# Altium project 002.botom.PrjPcb
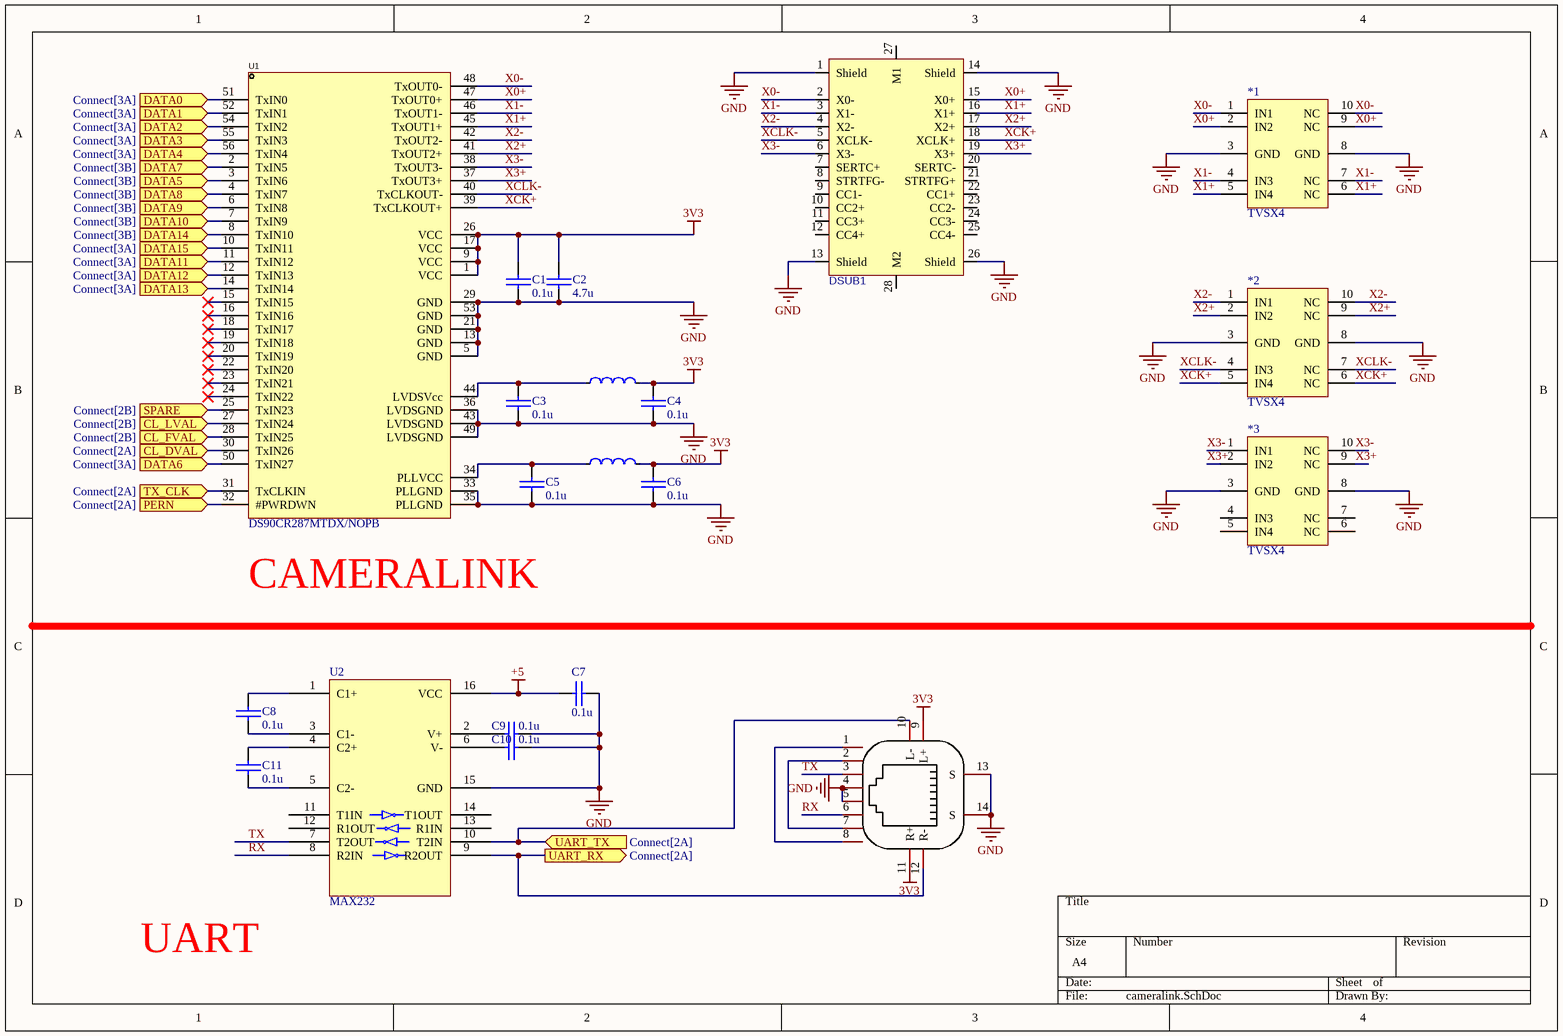
[diagram p0: cameralink.SchDoc]
3 sheets, 89 parts. Net scope: flat (ports and power ports of the same name join across sheets).
Board file: ccd_bottom.PcbDoc
Sheets:
  cameralink.SchDoc
  Connect.SchDoc
  power.SchDoc

## Sheet cameralink.SchDoc
size A4; SheetNumber: 2; SheetTotal: 4

### Parts
*1  TVSX4  [DFN-10]
*2  TVSX4  [DFN-10]
*3  TVSX4  [DFN-10]
C1  0.1u  [0603C]
C2  4.7u  [0603C]
C3  0.1u  [0603C]
C4  0.1u  [0603C]
C5  0.1u  [0603C]
C6  0.1u  [0603C]
C7  0.1u  [0603C]
C8  0.1u  [0603C]
C9  0.1u  [0603C]
C10  0.1u  [0603C]
C11  0.1u  [0603C]
DSUB1  6321-026RDS1MWA02  [MDR-26-horizontal]  (value not drawn)
L1  GZ1608D601TF  [0603L]  (value not drawn)
L2  GZ1608D601TF  [0603L]  (value not drawn)
RJ1  R-RJ45R08P-C000  [RJ45-TH_R-RJ45R08P-C000]  (value not drawn)
U1  DS90CR287MTDX/NOPB  [TSSOP-56_L14.0-W6.1-P0.50-LS8.1-BL]
U2  MAX232  [SOP16]

### Ports
CL_DVAL (in, see Connect[2A]), CL_FVAL (in, see Connect[2B]), CL_LVAL (in, see Connect[2B]), DATA0 (in, see Connect[3A]), DATA1 (in, see Connect[3A]), DATA2 (in, see Connect[3A]), DATA3 (in, see Connect[3A]), DATA4 (in, see Connect[3A]), DATA5 (in, see Connect[3B]), DATA6 (in, see Connect[3A]), DATA7 (in, see Connect[3B]), DATA8 (in, see Connect[3B]), DATA9 (in, see Connect[3B]), DATA10 (in, see Connect[3B]), DATA11 (in, see Connect[3A]), DATA12 (in, see Connect[3A]), DATA13 (in, see Connect[3A]), DATA14 (in, see Connect[3B]), DATA15 (in, see Connect[3A]), PERN (in, see Connect[2A]), SPARE (in, see Connect[2B]), TX_CLK (in, see Connect[2A]), UART_RX (out, see Connect[2A]), UART_TX (in, see Connect[2A])

### Nets
3V3: C1.2 C2.2 C4.2 C6.2 L1.2 L2.2 RJ1.9(L+) RJ1.11(R+) U1.1(VCC) U1.9(VCC) U1.17(VCC) U1.26(VCC)
+5: C7.2 U2.16(VCC)
GND: *1.3(GND) *1.8(GND) *2.3(GND) *2.8(GND) *3.3(GND) *3.8(GND) C1.1 C2.1 C3.1 C4.1 C5.1 C6.1 C7.1 C9.1 C10.1 DSUB1.1(Shield) DSUB1.13(Shield) DSUB1.14(Shield) DSUB1.26(Shield) RJ1.4 RJ1.5 RJ1.13(S) RJ1.14(S) U1.5(GND) U1.13(GND) U1.21(GND) U1.29(GND) U1.33(PLLGND) U1.35(PLLGND) U1.36(LVDSGND) U1.43(LVDSGND) U1.49(LVDSGND) U1.53(GND) U2.15(GND)
B15_IO0: RJ1.12(R-) U2.9(R2OUT) ; port UART_RX
B15_IO25: U1.50(TxIN27) ; port DATA6
B15_L1_N: U1.8(TxIN10) ; port DATA14
B15_L1_P: U1.7(TxIN9) ; port DATA10
B15_L2_N: U1.56(TxIN4) ; port DATA4
B15_L2_P: U1.55(TxIN3) ; port DATA3
B15_L3_N: U1.3(TxIN6) ; port DATA5
B15_L3_P: U1.2(TxIN5) ; port DATA7
B15_L4_N: U1.54(TxIN2) ; port DATA2
B15_L4_P: U1.52(TxIN1) ; port DATA1
B15_L5_N: U1.4(TxIN7) ; port DATA8
B15_L5_P: U1.6(TxIN8) ; port DATA9
B15_L7_P: U1.28(TxIN25) ; port CL_FVAL
B15_L9_N: U1.25(TxIN23) ; port SPARE
B15_L9_P: U1.27(TxIN24) ; port CL_LVAL
B15_L11_N: U1.10(TxIN11) ; port DATA15
B15_L11_P: U1.11(TxIN12) ; port DATA11
B15_L12_N: U1.12(TxIN13) ; port DATA12
B15_L12_P: U1.14(TxIN14) ; port DATA13
B16_IO0: RJ1.10(L-) U2.10(T2IN) ; port UART_TX
B16_IO25: U1.51(TxIN0) ; port DATA0
B16_L22_N: U1.30(TxIN26) ; port CL_DVAL
B16_L22_P: U1.31(TxCLKIN) ; port TX_CLK
B16_L23_N: U1.32(#PWRDWN) ; port PERN
RX: RJ1.6 U2.8(R2IN)
TX: RJ1.3 U2.7(T2OUT)
X0+: *1.2(IN2) *1.9(NC) DSUB1.15(X0+) U1.47(TxOUT0+)
X0-: *1.1(IN1) *1.10(NC) DSUB1.2(X0-) U1.48(TxOUT0-)
X1+: *1.5(IN4) *1.6(NC) DSUB1.16(X1+) U1.45(TxOUT1+)
X1-: *1.4(IN3) *1.7(NC) DSUB1.3(X1-) U1.46(TxOUT1-)
X2+: *2.2(IN2) *2.9(NC) DSUB1.17(X2+) U1.41(TxOUT2+)
X2-: *2.1(IN1) *2.10(NC) DSUB1.4(X2-) U1.42(TxOUT2-)
X3+: *3.2(IN2) *3.9(NC) DSUB1.19(X3+) U1.37(TxOUT3+)
X3-: *3.1(IN1) *3.10(NC) DSUB1.6(X3-) U1.38(TxOUT3-)
XCK+: *2.5(IN4) *2.6(NC) DSUB1.18(XCLK+) U1.39(TxCLKOUT+)
XCLK-: *2.4(IN3) *2.7(NC) DSUB1.5(XCLK-) U1.40(TxCLKOUT-)
NetC3_2: C3.2 L1.1 U1.44(LVDSVcc)
NetC5_2: C5.2 L2.1 U1.34(PLLVCC)
NetC8_1: C8.1 U2.3(C1-)
NetC8_2: C8.2 U2.1(C1+)
NetC9_2: C9.2 U2.2(V+)
NetC10_2: C10.2 U2.6(V-)
NetC11_1: C11.1 U2.5(C2-)
NetC11_2: C11.2 U2.4(C2+)
NetRJ1_1: RJ1.1 RJ1.8
NetRJ1_2: RJ1.2 RJ1.7

Not connected (* = marked no-connect by the designer): *3 4(IN3) 5(IN4) 6(NC) 7(NC); DSUB1 7(SERTC+) 8(STRTFG-) 9(CC1-) 10(CC2+) 11(CC3+) 12(CC4+) 20(SERTC-) 21(STRTFG+) 22(CC1+) 23(CC2-) 24(CC3-) 25(CC4-) 27(M1) 28(M2); U1 15(TxIN15)* 16(TxIN16)* 18(TxIN17)* 19(TxIN18)* 20(TxIN19)* 22(TxIN20)* 23(TxIN21)* 24(TxIN22)*; U2 11(T1IN) 12(R1OUT) 13(R1IN) 14(T1OUT)

### Notes on the sheet
- (near U1) CAMERALINK
- UART

### Library data of the parts
*1-*3 = TVSX4: 瞬态抑制二极管
C1-C11 = CAP: 无极性电容
DSUB1 = MDR-26: BOM_Manufacturer: Wcon; Contributor: LCSC; BOM_Supplier: LCSC; BOM_Supplier Part: C843200; BOM_Manufacturer Part: 6321-026RDS1MWA02; BOM_JLCPCB Part Class: Extended Part; spicePre: D; spiceSymbolName: 6321-026RDS1MWA02
L1 L2 = FB: 铁氧体磁珠; Manufacturer: Sunlord(顺络); Add into BOM: yes; Impedance @ Frequency: 600Ω@100MHz; Tolerance: ±25%; DC Resistance: 450mΩ; Current Rating: 200mA; Circuits: 1; Name: GZ1608D601TF; Symbol: GZ1608D601TF; Device: GZ1608D601TF; LCSC Part Name: 600Ω@100MHz ±25%; Supplier Part: C1002; Manufacturer Part: GZ1608D601TF; Supplier Footprint: 0603; JLCPCB Part Class: Basic Part; Datasheet: https://atta.szlcsc.com/upload/public/pdf/source/20210830/355EA7C0FAC5394FC0FE3F17C770C20A.pdf; Supplier: LCSC; Convert to PCB: yes
RJ1 = RJ45R08P: RJ45; Manufacturer: Ckmtw(灿科盟); Add into BOM: yes; Connector Type: RJ插座; Number of Ports: 1; Shielding: 有; LED: 带LED; Name: R-RJ45R08P-C000; Symbol: R-RJ45R08P-C000; Device: R-RJ45R08P-C000; LCSC Part Name: RJ45 弯插 带LED 8P/8C 铜壳带屏蔽 短体  无弹片; Supplier Part: C386757; Manufacturer Part: R-RJ45R08P-C000; Supplier Footprint: 插件; JLCPCB Part Class: Extended Part; Datasheet: https://atta.szlcsc.com/upload/public/pdf/source/20190508/C386757_590BCC8A33AAEEF7838490D656B2E4CF.pdf; Supplier: LCSC; Convert to PCB: yes; USOC Codes: RJ45; Ratings: -; Mounting Style: 弯插; Operating Temperature Range: 0℃~+70℃
U1 = DS90CR287MTDX/NOPB: cameralink编码; Manufacturer: TI(德州仪器); Add into BOM: yes; Name: DS90CR287MTDX/NOPB; Symbol: DS90CR287MTDX/NOPB; Device: DS90CR287MTDX/NOPB; LCSC Part Name: DS90CR287MTDX/NOPB; Supplier Part: C87059; Manufacturer Part: DS90CR287MTDX/NOPB; Supplier Footprint: TSSOP-56; JLCPCB Part Class: Extended Part; Datasheet: https://atta.szlcsc.com/upload/public/pdf/source/20181012/C87059_649258B21BE4DAB0D862C5E1E6C719D7.pdf; Supplier: LCSC; Convert to PCB: yes

## Sheet Connect.SchDoc
size A4; SheetNumber: 4; SheetTotal: 4
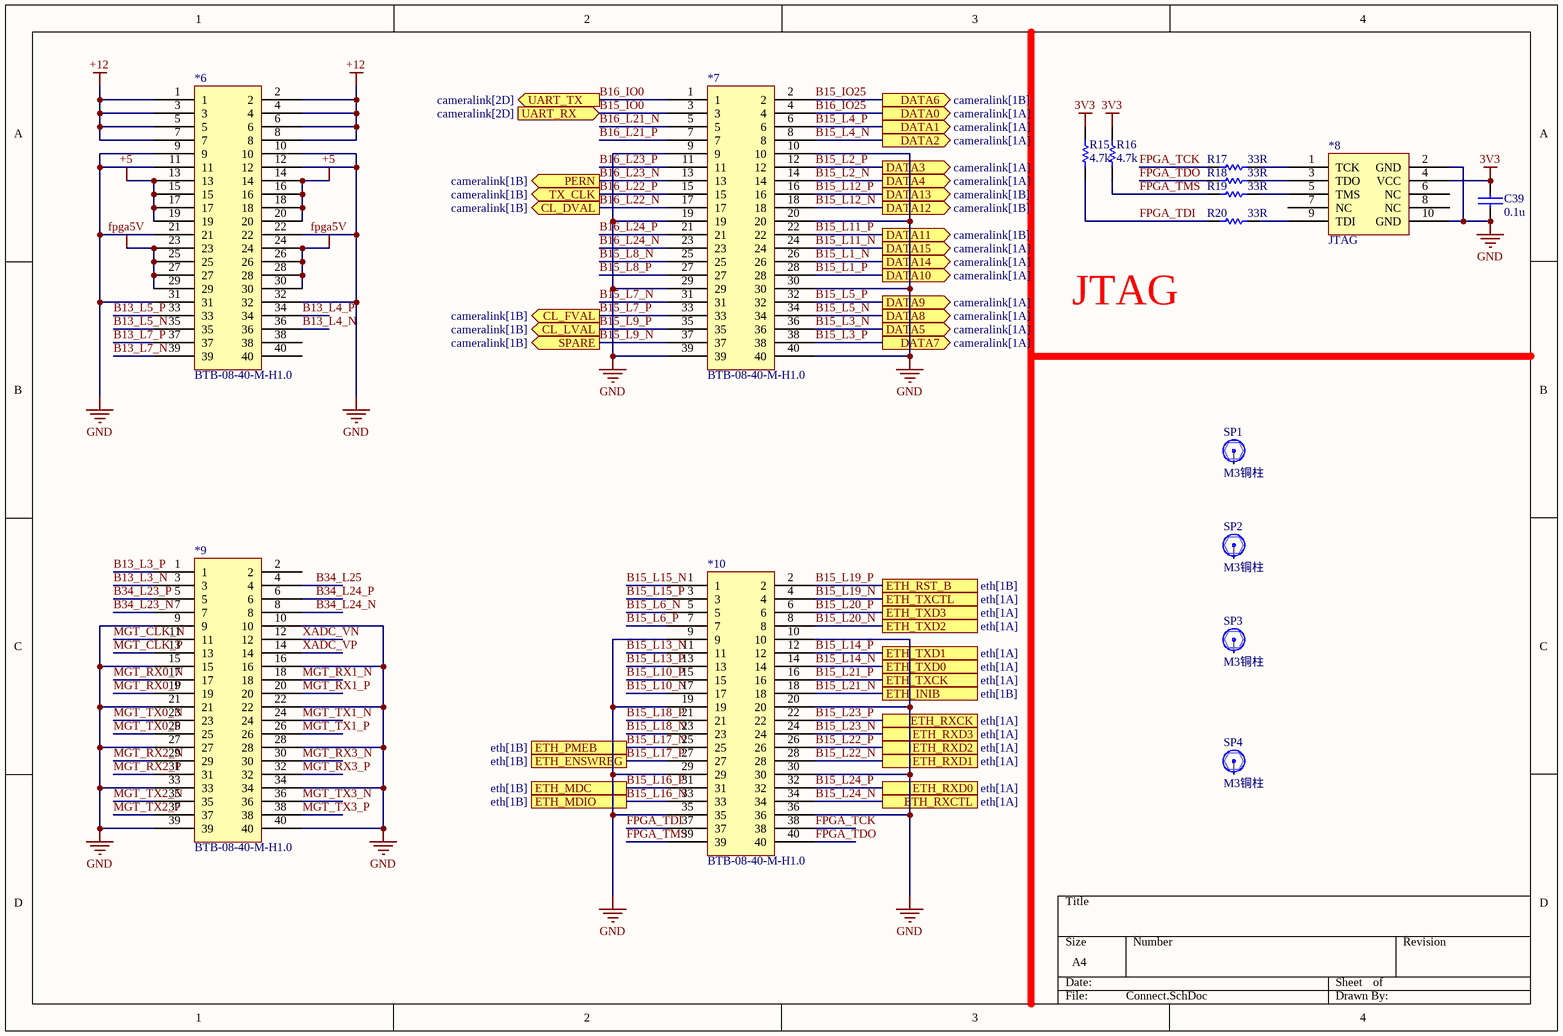
[diagram p1: Connect.SchDoc]

### Parts
*6  BTB-08-40-M-H1.0  [BTB-08-40-M-H1.0]
*7  BTB-08-40-M-H1.0  [BTB-08-40-M-H1.0]
*8  JTAG  [IDC-TH_10P-P2.54-H-R2-C5-S2.54]
*9  BTB-08-40-M-H1.0  [BTB-08-40-M-H1.0]
*10  BTB-08-40-M-H1.0  [BTB-08-40-M-H1.0]
C39  0.1u  [0603C]
R15  4.7k  [0603R]
R16  4.7k  [0603R]
R17  33R  [0603R]
R18  33R  [0603R]
R19  33R  [0603R]
R20  33R  [0603R]
SP1  M3铜柱  [M3x4_N]
SP2  M3铜柱  [M3x4_N]
SP3  M3铜柱  [M3x4_N]
SP4  M3铜柱  [M3x4_N]

### Ports
CL_DVAL (out, see cameralink[1B]), CL_FVAL (out, see cameralink[1B]), CL_LVAL (out, see cameralink[1B]), DATA0 (out, see cameralink[1A]), DATA1 (out, see cameralink[1A]), DATA2 (out, see cameralink[1A]), DATA3 (out, see cameralink[1A]), DATA4 (out, see cameralink[1A]), DATA5 (out, see cameralink[1A]), DATA6 (out, see cameralink[1B]), DATA7 (out, see cameralink[1A]), DATA8 (out, see cameralink[1A]), DATA9 (out, see cameralink[1A]), DATA10 (out, see cameralink[1A]), DATA11 (out, see cameralink[1B]), DATA12 (out, see cameralink[1B]), DATA13 (out, see cameralink[1B]), DATA14 (out, see cameralink[1A]), DATA15 (out, see cameralink[1A]), ETH_ENSWREG (see eth[1B]), ETH_INIB (see eth[1B]), ETH_MDC (see eth[1B]), ETH_MDIO (see eth[1B]), ETH_PMEB (see eth[1B]), ETH_RST_B (see eth[1B]), ETH_RXCK (see eth[1A]), ETH_RXCTL (see eth[1A]), ETH_RXD0 (see eth[1A]), ETH_RXD1 (see eth[1A]), ETH_RXD2 (see eth[1A]), ETH_RXD3 (see eth[1A]), ETH_TXCK (see eth[1A]), ETH_TXCTL (see eth[1A]), ETH_TXD0 (see eth[1A]), ETH_TXD1 (see eth[1A]), ETH_TXD2 (see eth[1A]), ETH_TXD3 (see eth[1A]), PERN (out, see cameralink[1B]), SPARE (out, see cameralink[1B]), TX_CLK (out, see cameralink[1B]), UART_RX (in, see cameralink[2D]), UART_TX (out, see cameralink[2D])

### Nets
3V3: *8.4(VCC) C39.2 R15.2 R16.2
+5: *6.13 *6.14 *6.15 *6.16 *6.17 *6.18 *6.19 *6.20
+12: *6.1 *6.2 *6.3 *6.4 *6.5 *6.6 *6.7 *6.8
fpga5V: *6.23 *6.24 *6.25 *6.26 *6.27 *6.28 *6.29 *6.30
GND: *6.9 *6.10 *6.11 *6.12 *6.21 *6.22 *6.31 *6.32 *7.9 *7.10 *7.19 *7.20 *7.29 *7.30 *7.39 *7.40 *8.2(GND) *8.10(GND) *9.9 *9.10 *9.15 *9.16 *9.21 *9.22 *9.27 *9.28 *9.33 *9.34 *9.39 *9.40 *10.9 *10.10 *10.19 *10.20 *10.29 *10.30 *10.35 *10.36 C39.1
B13_L3_N: *9.3
B13_L3_P: *9.1
B13_L4_N: *6.36
B13_L4_P: *6.34
B13_L5_N: *6.35
B13_L5_P: *6.33
B13_L7_N: *6.39
B13_L7_P: *6.37
B15_IO0: *7.3 ; port UART_RX
B15_IO25: *7.2 ; port DATA6
B15_L1_N: *7.26 ; port DATA14
B15_L1_P: *7.28 ; port DATA10
B15_L2_N: *7.14 ; port DATA4
B15_L2_P: *7.12 ; port DATA3
B15_L3_N: *7.36 ; port DATA5
B15_L3_P: *7.38 ; port DATA7
B15_L4_N: *7.8 ; port DATA2
B15_L4_P: *7.6 ; port DATA1
B15_L5_N: *7.34 ; port DATA8
B15_L5_P: *7.32 ; port DATA9
B15_L6_N: *10.5
B15_L6_P: *10.7
B15_L7_N: *7.31
B15_L7_P: *7.33 ; port CL_FVAL
B15_L8_N: *7.25
B15_L8_P: *7.27
B15_L9_N: *7.37 ; port SPARE
B15_L9_P: *7.35 ; port CL_LVAL
B15_L10_N: *10.17
B15_L10_P: *10.15
B15_L11_N: *7.24 ; port DATA15
B15_L11_P: *7.22 ; port DATA11
B15_L12_N: *7.18 ; port DATA12
B15_L12_P: *7.16 ; port DATA13
B15_L13_N: *10.11
B15_L13_P: *10.13
B15_L14_N: *10.14 ; port ETH_TXD0
B15_L14_P: *10.12 ; port ETH_TXD1
B15_L15_N: *10.1
B15_L15_P: *10.3
B15_L16_N: *10.33 ; port ETH_MDIO
B15_L16_P: *10.31 ; port ETH_MDC
B15_L17_N: *10.25 ; port ETH_PMEB
B15_L17_P: *10.27 ; port ETH_ENSWREG
B15_L18_N: *10.23
B15_L18_P: *10.21
B15_L19_N: *10.4 ; port ETH_TXCTL
B15_L19_P: *10.2 ; port ETH_RST_B
B15_L20_N: *10.8 ; port ETH_TXD2
B15_L20_P: *10.6 ; port ETH_TXD3
B15_L21_N: *10.18 ; port ETH_INIB
B15_L21_P: *10.16 ; port ETH_TXCK
B15_L22_N: *10.28 ; port ETH_RXD1
B15_L22_P: *10.26 ; port ETH_RXD2
B15_L23_N: *10.24 ; port ETH_RXD3
B15_L23_P: *10.22 ; port ETH_RXCK
B15_L24_N: *10.34 ; port ETH_RXCTL
B15_L24_P: *10.32 ; port ETH_RXD0
B16_IO0: *7.1 ; port UART_TX
B16_IO25: *7.4 ; port DATA0
B16_L21_N: *7.5
B16_L21_P: *7.7
B16_L22_N: *7.17 ; port CL_DVAL
B16_L22_P: *7.15 ; port TX_CLK
B16_L23_N: *7.13 ; port PERN
B16_L23_P: *7.11
B16_L24_N: *7.23
B16_L24_P: *7.21
B34_L23_N: *9.7
B34_L23_P: *9.5
B34_L24_N: *9.8
B34_L24_P: *9.6
B34_L25: *9.4
FPGA_TCK: *10.38 R17.1
FPGA_TDI: *10.37 R15.1 R20.1
FPGA_TDO: *10.40 R18.1
FPGA_TMS: *10.39 R16.1 R19.1
MGT_CLK_N: *9.11
MGT_CLK_P: *9.13
MGT_RX0_N: *9.17
MGT_RX0_P: *9.19
MGT_RX1_N: *9.18
MGT_RX1_P: *9.20
MGT_RX2_N: *9.29
MGT_RX2_P: *9.31
MGT_RX3_N: *9.30
MGT_RX3_P: *9.32
MGT_TX0_N: *9.23
MGT_TX0_P: *9.25
MGT_TX1_N: *9.24
MGT_TX1_P: *9.26
MGT_TX2_N: *9.35
MGT_TX2_P: *9.37
MGT_TX3_N: *9.36
MGT_TX3_P: *9.38
XADC_VN: *9.12
XADC_VP: *9.14
Net*8_1: *8.1(TCK) R17.2
Net*8_3: *8.3(TDO) R18.2
Net*8_5: *8.5(TMS) R19.2
Net*8_9: *8.9(TDI) R20.2

Not connected (* = marked no-connect by the designer): *6 38 40; *8 6(NC) 7(NC) 8(NC); *9 2; SP1 1; SP2 1; SP3 1; SP4 1

### Notes on the sheet
- JTAG

### Library data of the parts
C39 = CAP: 无极性电容
R15-R20 = RES: 电阻
SP1-SP4 = 铜柱大焊盘: 铜柱; 版权归属: 封装库来自淘宝 ID：黄晶宝石; BOM名称: 铜柱; 学习资源: https://shop463601444.taobao.com

## Sheet power.SchDoc
size A4; SheetNumber: 1; SheetTotal: 4
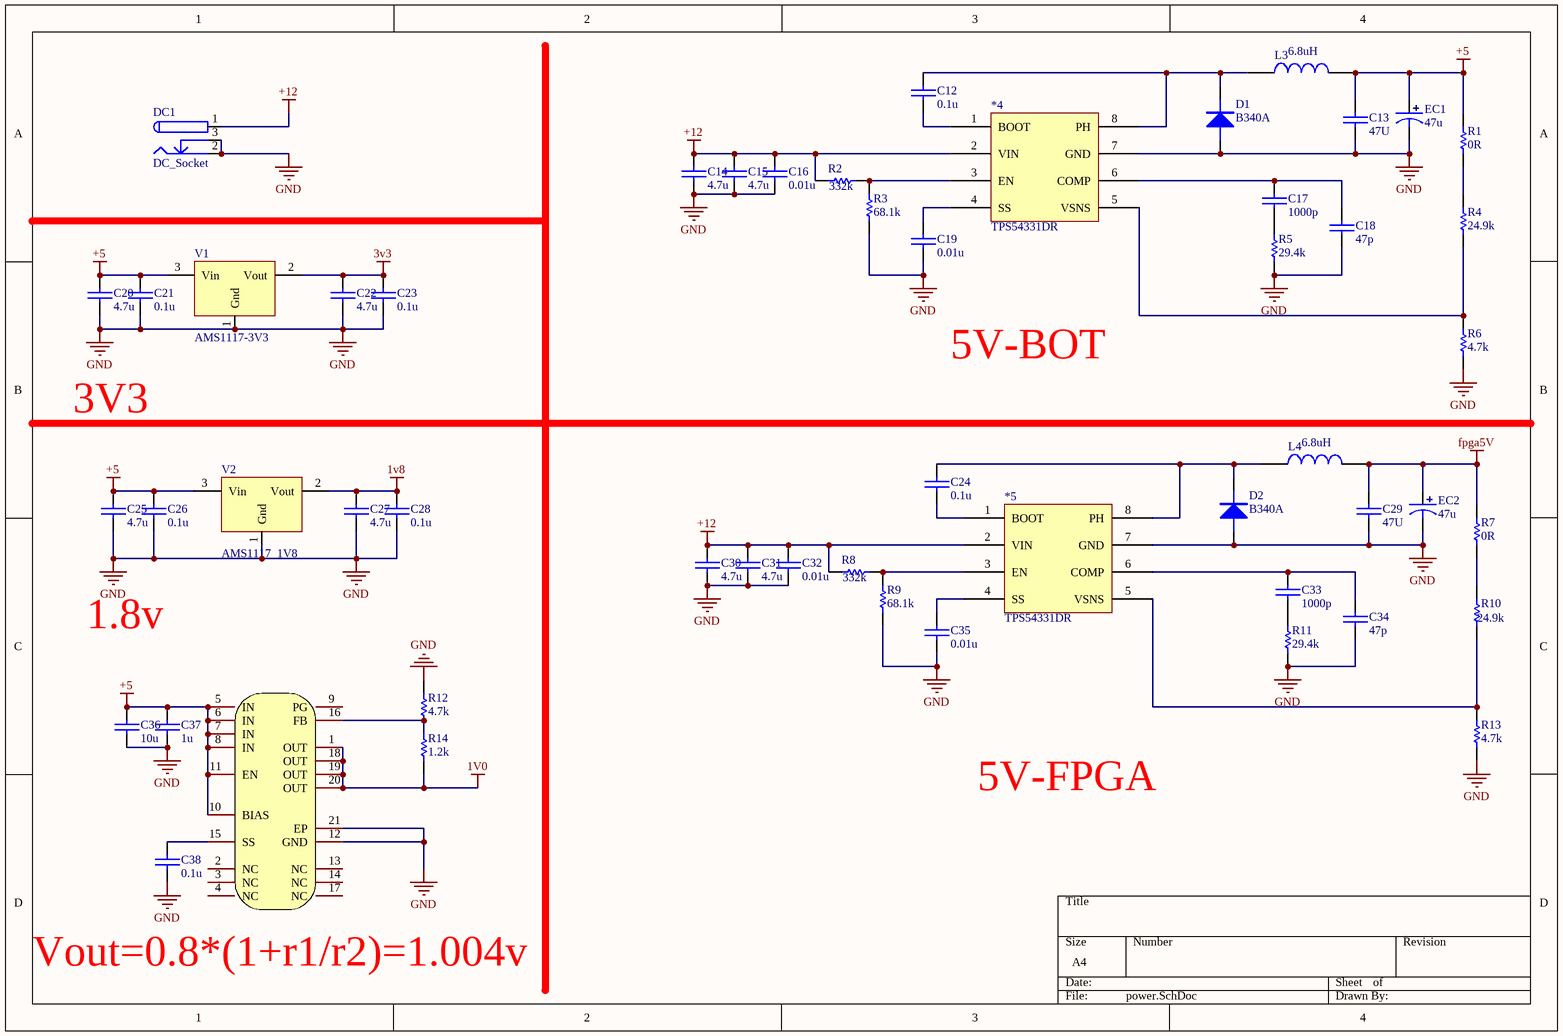
[diagram p2: power.SchDoc]

### Parts
*4  TPS54331DR  [SOIC-8]
*5  TPS54331DR  [SOIC-8]
C12  0.1u  [0603C]
C13  47U  [0603C]
C14  4.7u  [0603C]
C15  4.7u  [0603C]
C16  0.01u  [0603C]
C17  1000p  [0603C]
C18  47p  [0603C]
C19  0.01u  [0603C]
C20  4.7u  [0603C]
C21  0.1u  [0603C]
C22  4.7u  [0603C]
C23  0.1u  [0603C]
C24  0.1u  [0603C]
C25  4.7u  [0603C]
C26  0.1u  [0603C]
C27  4.7u  [0603C]
C28  0.1u  [0603C]
C29  47U  [0603C]
C30  4.7u  [0603C]
C31  4.7u  [0603C]
C32  0.01u  [0603C]
C33  1000p  [0603C]
C34  47p  [0603C]
C35  0.01u  [0603C]
C36  10u  [0603C]
C37  1u  [0603C]
C38  0.1u  [0603C]
D1  B340A  [SMA/DO-214AC]
D2  B340A  [SMA/DO-214AC]
DC1  DC_Socket  [DC-005]
EC1  47u  [SMD-EC6.3X6.3X10]
EC2  47u  [SMD-EC6.3X6.3X10]
L3  6.8uH  [L-SMD-0630]
L4  6.8uH  [L-SMD-0630]
R1  0R  [0603R]
R2  332k  [0603R]
R3  68.1k  [0603R]
R4  24.9k  [0603R]
R5  29.4k  [0603R]
R6  4.7k  [0603R]
R7  0R  [0603R]
R8  332k  [0603R]
R9  68.1k  [0603R]
R10  24.9k  [0603R]
R11  29.4k  [0603R]
R12  4.7k  [0603R]
R13  4.7k  [0603R]
R14  1.2k  [0603R]
U3  TPS74401RGWR  [VQFN-20_L5.0-W5.0-P0.65-TL-EP]  (value not drawn)
V1  AMS1117-3V3  [SOT223_L]
V2  AMS1117_1V8  [SOT223_L]

### Nets
1V0: R14.1 U3.1(OUT) U3.18(OUT) U3.19(OUT) U3.20(OUT)
1v8: C27.2 C28.2 V2.2(Vout)
3V3: C22.2 C23.2 V1.2(Vout)
+5: C13.2 C20.2 C21.2 C25.2 C26.2 C36.2 C37.2 EC1.1 L3.2 R1.2 U3.5(IN) U3.6(IN) U3.7(IN) U3.8(IN) U3.10(BIAS) U3.11(EN) V1.3(Vin) V2.3(Vin)
+12: *4.2(VIN) *5.2(VIN) C14.2 C15.2 C16.2 C30.2 C31.2 C32.2 DC1.1 R2.2 R8.2
fpga5V: C29.2 EC2.1 L4.2 R7.2
GND: *4.7(GND) *5.7(GND) C13.1 C14.1 C15.1 C16.1 C18.1 C19.1 C20.1 C21.1 C22.1 C23.1 C25.1 C26.1 C27.1 C28.1 C29.1 C30.1 C31.1 C32.1 C34.1 C35.1 C36.1 C37.1 C38.1 D1.A D2.A DC1.2 DC1.3 EC1.2 EC2.2 R3.1 R5.1 R6.1 R9.1 R11.1 R12.2 R13.1 U3.12(GND) U3.21(EP) V1.1(Gnd) V2.1(Gnd)
Net*4_1: *4.1(BOOT) C12.1
Net*4_3: *4.3(EN) R2.1 R3.2
Net*4_4: *4.4(SS) C19.2
Net*4_5: *4.5(VSNS) R4.1 R6.2
Net*4_6: *4.6(COMP) C17.2 C18.2
Net*4_8: *4.8(PH) C12.2 D1.K L3.1
Net*5_1: *5.1(BOOT) C24.1
Net*5_3: *5.3(EN) R8.1 R9.2
Net*5_4: *5.4(SS) C35.2
Net*5_5: *5.5(VSNS) R10.1 R13.2
Net*5_6: *5.6(COMP) C33.2 C34.2
Net*5_8: *5.8(PH) C24.2 D2.K L4.1
NetC17_1: C17.1 R5.2
NetC33_1: C33.1 R11.2
NetC38_2: C38.2 U3.15(SS)
NetR1_1: R1.1 R4.2
NetR7_1: R7.1 R10.2
NetR12_1: R12.1 R14.2 U3.16(FB)

Not connected (* = marked no-connect by the designer): U3 2(NC) 3(NC) 4(NC) 9(PG) 13(NC) 14(NC) 17(NC)

### Notes on the sheet
- 5V-BOT
- 3V3
- 1.8v
- 5V-FPGA
- (near U3) Vout=0.8*(1+r1/r2)=1.004v

### Library data of the parts
*4 *5 = TPS54331DR: 降压型DC-DC
C12-C38 = CAP: 无极性电容
D1 D2 = DIODE: 普通二极管
EC1 EC2 = ECAP: 贴片电解电容
L3 L4 = L: INDUCTOR
R1-R14 = RES: 电阻
U3 = TPS74401RGWR: 单路输出 LDO、3.0A、可调节电压（0.8 至 3.3V）、快速瞬态响应、可编程软启动; Manufacturer: TI(德州仪器); Add into BOM: yes; Voltage - Input (Max): 5.5V; Voltage Dropout (Max): 240mV @ 3A; Voltage - Output (adj): 0.8V ~ 3.6V; Output Current (Max): 3A; Output Configuration: 正; Ripple Rejection (PSRR): 73dB ~ 50dB(1kHz ~ 800kHz); Output Type: 可调式; Number of Output Channels: 1; Name: TPS74401RGWR; Symbol: TPS74401RGWR; Device: TPS74401RGWR; LCSC Part Name: TPS74401RGWR; Supplier Part: C138728; Manufacturer Part: TPS74401RGWR; Supplier Footprint: VQFN-20_5x5x065P; JLCPCB Part Class: Extended Part; Datasheet: https://atta.szlcsc.com/upload/public/pdf/source/20171102/C138728_15096093098431078457.pdf; Supplier: LCSC; Convert to PCB: yes; Quiescent Current (Iq): -; Current - Supply (Max): -; Operating Temperature: -40℃~125℃(TJ); Enabling feet: -; Voltage - Output (Fixed): -
V1 = AMS1117-3V3: LDO; BOM名称: 稳压芯片; 封装库来自淘宝卖家：黄晶宝石: 其他店铺购入的买家，请立即申请退款，本店现金奖励200~1000元
V2 = AMS1117_1V8: LDO; BOM名称: 稳压芯片; 封装库来自淘宝卖家：黄晶宝石: 其他店铺购入的买家，请立即申请退款，本店现金奖励200~1000元

## Nets that join several sheets
3V3: cameralink (12 pins), Connect (*8.4 C39.2 R15.2 R16.2), power (C22.2 C23.2 V1.2)
+5: cameralink (C7.2 U2.16), Connect (8 pins), power (18 pins)
+12: Connect (8 pins), power (11 pins)
fpga5V: Connect (8 pins), power (C29.2 EC2.1 L4.2 R7.2)
GND: cameralink (34 pins), Connect (39 pins), power (42 pins)
B15_IO0: cameralink (RJ1.12 U2.9), Connect (*7.3)
B15_IO25: cameralink (U1.50), Connect (*7.2)
B15_L1_N: cameralink (U1.8), Connect (*7.26)
B15_L1_P: cameralink (U1.7), Connect (*7.28)
B15_L2_N: cameralink (U1.56), Connect (*7.14)
B15_L2_P: cameralink (U1.55), Connect (*7.12)
B15_L3_N: cameralink (U1.3), Connect (*7.36)
B15_L3_P: cameralink (U1.2), Connect (*7.38)
B15_L4_N: cameralink (U1.54), Connect (*7.8)
B15_L4_P: cameralink (U1.52), Connect (*7.6)
B15_L5_N: cameralink (U1.4), Connect (*7.34)
B15_L5_P: cameralink (U1.6), Connect (*7.32)
B15_L7_P: cameralink (U1.28), Connect (*7.33)
B15_L9_N: cameralink (U1.25), Connect (*7.37)
B15_L9_P: cameralink (U1.27), Connect (*7.35)
B15_L11_N: cameralink (U1.10), Connect (*7.24)
B15_L11_P: cameralink (U1.11), Connect (*7.22)
B15_L12_N: cameralink (U1.12), Connect (*7.18)
B15_L12_P: cameralink (U1.14), Connect (*7.16)
B16_IO0: cameralink (RJ1.10 U2.10), Connect (*7.1)
B16_IO25: cameralink (U1.51), Connect (*7.4)
B16_L22_N: cameralink (U1.30), Connect (*7.17)
B16_L22_P: cameralink (U1.31), Connect (*7.15)
B16_L23_N: cameralink (U1.32), Connect (*7.13)